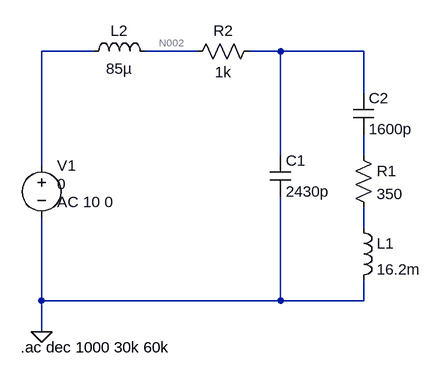
[diagram p0: schematic MA40P16 Transducer impedance.asc]
MA40P16 Transducer impedance.asc, the LTspice schematic file:
Version 4
SHEET 1 880 680
WIRE -208 -288 -288 -288
WIRE -48 -288 -128 -288
WIRE 80 -288 32 -288
WIRE 208 -288 80 -288
WIRE 208 -224 208 -288
WIRE 80 -128 80 -288
WIRE 208 -128 208 -160
WIRE -288 -112 -288 -288
WIRE 208 -16 208 -48
WIRE -288 96 -288 -32
WIRE 80 96 80 -64
WIRE 80 96 -288 96
WIRE 208 96 208 64
WIRE 208 96 80 96
WIRE -288 144 -288 96
FLAG -288 144 0
SYMBOL ind 192 -32 R0
SYMATTR InstName L1
SYMATTR Value 16.2m
SYMBOL res 192 -144 R0
SYMATTR InstName R1
SYMATTR Value 350
SYMBOL cap 192 -224 R0
SYMATTR InstName C2
SYMATTR Value 1600p
SYMBOL voltage -288 -128 R0
WINDOW 3 24 44 Left 2
WINDOW 123 24 72 Left 2
WINDOW 39 0 0 Left 0
SYMATTR Value 0
SYMATTR Value2 AC 10 0
SYMATTR InstName V1
SYMBOL res 48 -304 R90
WINDOW 0 0 56 VBottom 2
WINDOW 3 32 56 VTop 2
SYMATTR InstName R2
SYMATTR Value 1k
SYMBOL cap 64 -128 R0
SYMATTR InstName C1
SYMATTR Value 2430p
SYMBOL ind -224 -272 R270
WINDOW 0 32 56 VTop 2
WINDOW 3 5 56 VBottom 2
SYMATTR InstName L2
SYMATTR Value 85µ
TEXT -320 168 Left 2 !.ac dec 1000 30k 60k

The netlist it stands for:
* MA40P16 Transducer impedance.asc
L1 N005 0 16.2m
R1 N004 N005 350
C2 N003 N004 1600p
V1 N001 0 0 AC 10 0
R2 N003 N002 1k
C1 N003 0 2430p
L2 N001 N002 85µ
.ac dec 1000 30k 60k
.backanno
.end

* Results of the author's LTspice run, read from the files saved beside the schematic
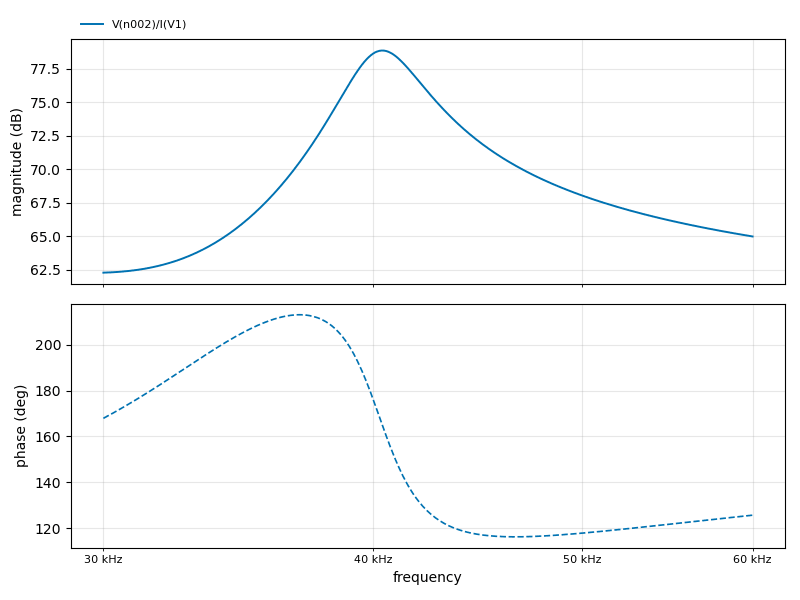
[diagram p1: AC Analysis of MA40P16 Transducer impedance.asc, plotted from the saved traces]
* AC Analysis, 1 run:
*   V(n002)/I(V1): 62.29 dB at 30 kHz, 64.99 dB at 60 kHz, peak 78.84 dB at 40.38 kHz, 3 dB below the peak at 38.83 kHz and 42.39 kHz